# Altium schematic sheet Top.SchDoc
size A4
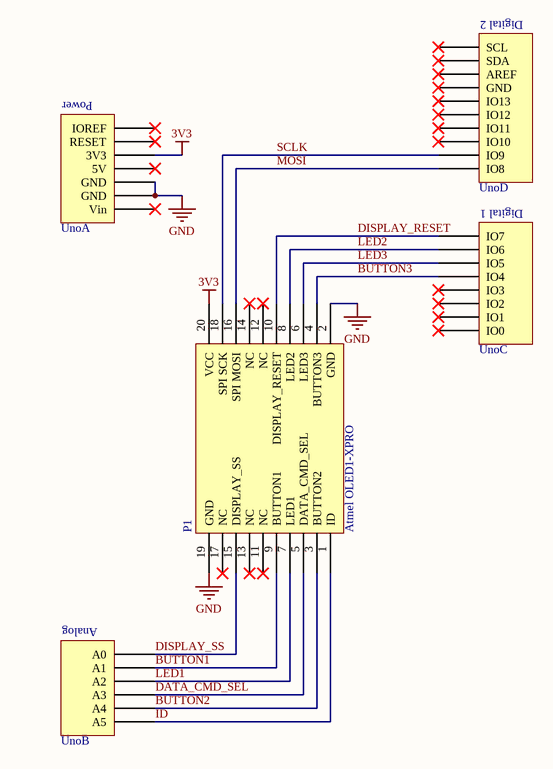
[diagram p0: Top.SchDoc]

## Parts
P1  Atmel OLED1-XPRO
Uno  Arduino Uno Shield  [Arduino Uno Shield]  (value not drawn)  (parts A,B,C,D of 5)

## Nets
3V3: P1.20(VCC) Uno.3V3
GND: P1.2(GND) P1.19(GND) Uno.GND1(GND) Uno.GND2(GND)
BUTTON1: P1.9(BUTTON1) Uno.A1
BUTTON2: P1.3(BUTTON2) Uno.A4
BUTTON3: P1.4(BUTTON3) Uno.4(IO4)
DATA_CMD_SEL: P1.5(DATA_CMD_SEL) Uno.A3
DISPLAY_RESET: P1.10(DISPLAY_RESET) Uno.7(IO7)
DISPLAY_SS: P1.15(DISPLAY_SS) Uno.A0
ID: P1.1(ID) Uno.A5
LED1: P1.7(LED1) Uno.A2
LED2: P1.8(LED2) Uno.6(IO6)
LED3: P1.6(LED3) Uno.5(IO5)
MOSI: P1.16(SPI_MOSI) Uno.8(IO8)
SCLK: P1.18(SPI_SCK) Uno.9(IO9)

Not connected (* = marked no-connect by the designer): P1 11(NC)* 12(NC)* 13(NC)* 14(NC)* 17(NC)*; Uno 0(IO0)* 1(IO1)* 2(IO2)* 3(IO3)* 5V* 10(IO10)* 11(IO11)* 12(IO12)* 13(IO13)* AREF* GND3(GND)* IOREF* RESET* SCL* SDA* Vin*

## Notes on the sheet
- (in symbol Arduino Uno, part A) Power
- (in symbol Arduino Uno, part B) Analog
- (in symbol Arduino Uno, part C) Digital 1
- (in symbol Arduino Uno, part D) Digital 2

## Library data of the parts
Uno = Arduino Uno